# Altium schematic sheet connector.SchDoc: PCIE-Connector
size A4; Author: Marcel Hellwig; Organization: Hamburg Bit-Bots; Address1: Vogt-Kölln-Str. 30; Address2: 22527 Hamburg; Address3: Germany; Address4: www.bit-bots.de; DocumentNumber: 10; Revision: A; SheetNumber: 10; SheetTotal: 16; EMail: info@bit-bots.de
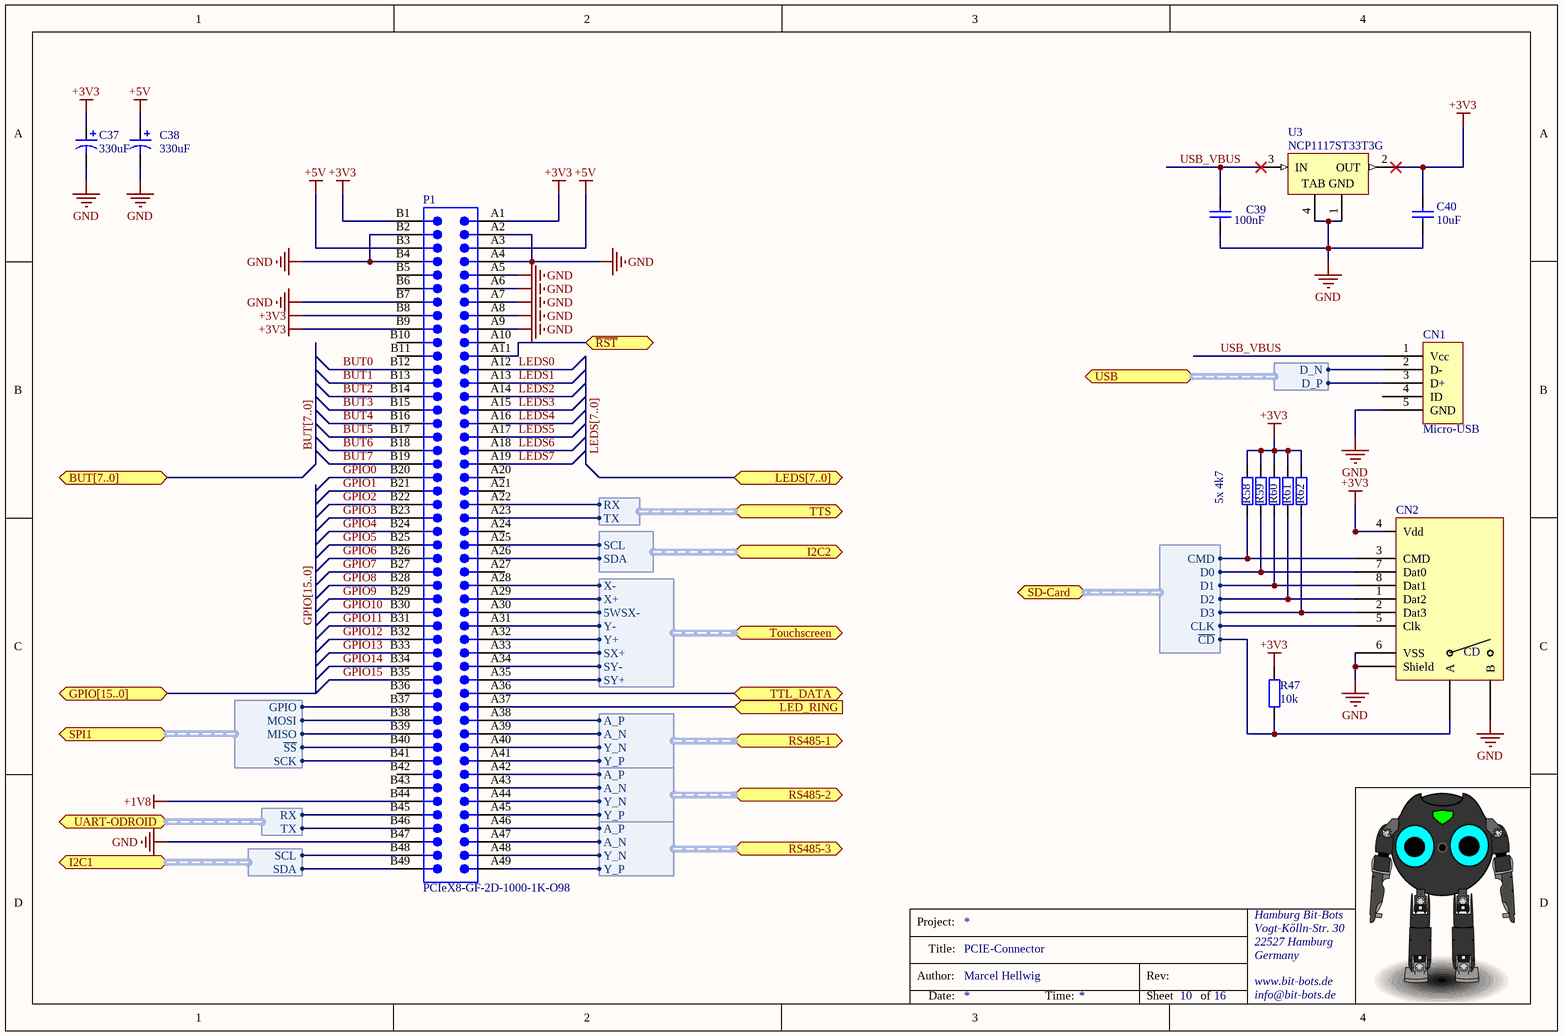
[diagram p0: connector.SchDoc]

## Parts
C37  330uF  [Cap 10mm]
C38  330uF  [Cap 10mm]
C39  100nF  [C2012]
C40  10uF  [C2012]
CN1  Micro-USB  [USB-MicroB]
CN2  microSD  [Microsd]  (value not drawn)
P1  PCIeX8-GF-2D-1000-1K-O98  [PCIeX8-GF-2D-1000-1K-O98]  (no BOM)
R47  10k  [R2012]
R58  4k7  [R2012]  (value not drawn)
R59  4k7  [R2012]  (value not drawn)
R60  4k7  [R2012]  (value not drawn)
R61  4k7  [R2012]  (value not drawn)
R62  4k7  [R2012]  (value not drawn)
U3  NCP1117ST33T3G  [ONSC-SOT-223_L]

## Ports
BUT[7..0] (bidir), GPIO[15..0] (bidir), I2C1 (harness I²C), I2C2 (harness I²C), LED_RING (in), LEDS[7..0] (bidir), RS485-1 (harness RS-485), RS485-2 (harness RS-485), RS485-3 (harness RS-485), SD-Card (harness SD-Card), SPI1 (harness SPI), Touchscreen (harness Touchscreen), TTL_DATA (bidir), TTS (harness UART), UART-ODROID (harness UART), USB (harness USB), ~{RST}

## Harnesses
USB: D_N, D_P
UART: RX, TX
I²C: SCL, SDA
Touchscreen: 5WSX-, SX+, SY-, SY+, X-, X+, Y-, Y+
RS-485: A_P, A_N, Y_P, Y_N
SD-Card: CLK, CMD, D0, D1, D2, D3, ~{CD}
SPI: ~{SS}, GPIO, MISO, MOSI, SCK

## Nets
+1V8: P1.B44
+3V3: C37.1 C40.2 CN2.4(Vdd) P1.A1 P1.B1 P1.B8 P1.B9 R47.2 R58.1 R59.1 R60.1 R61.1 R62.1 U3.2(OUT)
+5V: C38.1 P1.A3 P1.B3
GND: C37.2 C38.2 C39.1 C40.1 CN1.5(GND) CN2.6(VSS) CN2.B CN2.sh(Shield) P1.A2 P1.A4 P1.A5 P1.A6 P1.A7 P1.A8 P1.A9 P1.B2 P1.B4 P1.B7 P1.B47 U3.1(GND) U3.4(TAB)
~{RST}: P1.A11 ; port ~{RST}
BUT0: P1.B12
BUT1: P1.B13
BUT2: P1.B14
BUT3: P1.B15
BUT4: P1.B16
BUT5: P1.B17
BUT6: P1.B18
BUT7: P1.B19
GPIO0: P1.B20
GPIO1: P1.B21
GPIO2: P1.B22
GPIO3: P1.B23
GPIO4: P1.B24
GPIO5: P1.B25
GPIO6: P1.B26
GPIO7: P1.B27
GPIO8: P1.B28
GPIO9: P1.B29
GPIO10: P1.B30
GPIO11: P1.B31
GPIO12: P1.B32
GPIO13: P1.B33
GPIO14: P1.B34
GPIO15: P1.B35
LED_RING: P1.A37 ; port LED_RING
LEDS0: P1.A12
LEDS1: P1.A13
LEDS2: P1.A14
LEDS3: P1.A15
LEDS4: P1.A16
LEDS5: P1.A17
LEDS6: P1.A18
LEDS7: P1.A19
TTL_DATA: P1.A36 ; port TTL_DATA
USB_VBUS: C39.2 CN1.1(Vcc) U3.3(IN)
NetCN1_2: CN1.2(D-) ; port USB.D_N
NetCN1_3: CN1.3(D+) ; port USB.D_P
NetCN2_1: CN2.1(Dat2) R61.2 ; port SD-Card.D2
NetCN2_2: CN2.2(Dat3) R62.2 ; port SD-Card.D3
NetCN2_3: CN2.3(CMD) R58.2 ; port SD-Card.CMD
NetCN2_5: CN2.5(Clk) ; port SD-Card.CLK
NetCN2_7: CN2.7(Dat0) R59.2 ; port SD-Card.D0
NetCN2_8: CN2.8(Dat1) R60.2 ; port SD-Card.D1
NetCN2_A: CN2.A R47.1 ; port SD-Card.~{CD}
NetP1_A22: P1.A22 ; port TTS.RX
NetP1_A23: P1.A23 ; port TTS.TX
NetP1_A25: P1.A25 ; port I2C2.SCL
NetP1_A26: P1.A26 ; port I2C2.SDA
NetP1_A28: P1.A28 ; port Touchscreen.X-
NetP1_A29: P1.A29 ; port Touchscreen.X+
NetP1_A30: P1.A30 ; port Touchscreen.5WSX-
NetP1_A31: P1.A31 ; port Touchscreen.Y-
NetP1_A32: P1.A32 ; port Touchscreen.Y+
NetP1_A33: P1.A33 ; port Touchscreen.SX+
NetP1_A34: P1.A34 ; port Touchscreen.SY-
NetP1_A35: P1.A35 ; port Touchscreen.SY+
NetP1_A38: P1.A38 ; port RS485-1.A_P
NetP1_A39: P1.A39 ; port RS485-1.A_N
NetP1_A40: P1.A40 ; port RS485-1.Y_N
NetP1_A41: P1.A41 ; port RS485-1.Y_P
NetP1_A42: P1.A42 ; port RS485-2.A_P
NetP1_A43: P1.A43 ; port RS485-2.A_N
NetP1_A44: P1.A44 ; port RS485-2.Y_N
NetP1_A45: P1.A45 ; port RS485-2.Y_P
NetP1_A46: P1.A46 ; port RS485-3.A_P
NetP1_A47: P1.A47 ; port RS485-3.A_N
NetP1_A48: P1.A48 ; port RS485-3.Y_N
NetP1_A49: P1.A49 ; port RS485-3.Y_P
NetP1_B37: P1.B37 ; port SPI1.GPIO
NetP1_B38: P1.B38 ; port SPI1.MOSI
NetP1_B39: P1.B39 ; port SPI1.MISO
NetP1_B40: P1.B40 ; port SPI1.~{SS}
NetP1_B41: P1.B41 ; port SPI1.SCK
NetP1_B45: P1.B45 ; port UART-ODROID.RX
NetP1_B46: P1.B46 ; port UART-ODROID.TX
NetP1_B48: P1.B48 ; port I2C1.SCL
NetP1_B49: P1.B49 ; port I2C1.SDA

Not connected (* = marked no-connect by the designer): CN1 4(ID); P1 A10 A20 A21 A24 A27 B5 B6 B10 B11 B36 B42 B43

## Buses and harness runs
bus BUT[7..0] = port BUT[7..0]
bus GPIO[15..0] = port GPIO[15..0]
bus LEDS[7..0] = port LEDS[7..0]

## Notes on the sheet
- 5x 4k7
- Project:
- Author:
- Title:
- Rev:
- Date:
- Time:
- Sheet
- of
- (in symbol microSD) CD

## Library data of the parts
C37 C38 = Cap Pol1: Polarized Capacitor (Radial); Manufacturer: PANASONIC ELECTRONIC COMPONENTS; Manufacturer Part Number: EEE1VA331UAP; Published: 8-Jun-2000; LatestRevisionDate: 17-Jul-2002; LatestRevisionNote: Re-released for DXP Platform.; PackageReference: RB7.6-15; Publisher: Altium Limited; PackageDescription: Polarized Capacitor (Radial); 2 Leads; Value: 330uF; Supplier 1: Farnell; Supplier Part Number 1: 2326180; RoHS: YES; Stock 1: 534; Pricing 1: 1=0,89, 10=0,619, 50=0,445, 100=0,309, 250=0,279, 500=0,259, 2500=0,219, 5000=0,195 (EUR); ComponentLink1URL: http://www.farnell.com/datasheets/1790637.pdf; ComponentLink1Description: http://www.farnell.com/datasheets/1790637.pdf
C39 = Cap: Capacitor; Manufacturer: MULTICOMP; Manufacturer Part Number: MC0805B104K500CT; Produktpalette: Baureihe MC; Kapazität: 0.1; Kapazitätstoleranz: ±10%; Dielektrikum: X7; Nennspannung: 50; Keramikkondensatorgehäuse: 0805 [Metrisch 2012]; Betriebstemperatur, min.: -55; Betriebstemperatur, max.: 125; Verpackung: Gurtabschnitt; SVHC: No SVHC (17-Dec-2014); Betriebstemperatur: -55°C bis +125; Kondensatoranschlüsse: SMD<!--FANDB--><div class="features-and-benefits-container"></div>; Published: 8-Jun-2000; LatestRevisionDate: 17-Jul-2002; LatestRevisionNote: Re-released for DXP Platform.; PackageReference: RAD-0.3; Publisher: Altium Limited; PackageDescription: Radial Cap, Thru-Hole; 2 Leads; 0.3 in Pin Spacing; Value: 100nF; Supplier 1: Farnell; Supplier Part Number 1: 1759265; RoHS: YES; Stock 1: 692587; Pricing 1: 10=0,013, 100=0,011, 500=0,009, 1000=0,008, 2000=0,006 (EUR); MSL: -; Bauform: 0805 [Metrisch 2012]; Kapazitätstoleranz ±: ±10%; ComponentLink1URL: http://www.farnell.com/datasheets/1870456.pdf; ComponentLink1Description: http://www.farnell.com/datasheets/1870456.pdf
C40 = Cap: Capacitor; Manufacturer: MULTICOMP; Manufacturer Part Number: MC0805X106K250CT; Produktpalette: Baureihe MC; Kapazität: 10; Kapazitätstoleranz: ±10%; Dielektrikum: X5; Nennspannung: 25; Keramikkondensatorgehäuse: 0805 [Metrisch 2012]; Betriebstemperatur, min.: -55; Betriebstemperatur, max.: 85; Verpackung: Gurtabschnitt; Kondensatoranschlüsse: SMD<!--FANDB--><div class="features-and-benefits-container"></div>; Published: 8-Jun-2000; LatestRevisionDate: 17-Jul-2002; LatestRevisionNote: Re-released for DXP Platform.; PackageReference: RAD-0.3; Publisher: Altium Limited; PackageDescription: Radial Cap, Thru-Hole; 2 Leads; 0.3 in Pin Spacing; Value: 10uF; Supplier 1: Farnell; Supplier Part Number 1: 2320833; RoHS: YES; Stock 1: 46180; Pricing 1: 10=0,147, 100=0,121, 500=0,1, 1000=0,083, 1500=0,066 (EUR); MSL: MSL 1 - unbegrenzt; Bauform: 0805 [Metrisch 2012]; Kapazitätstoleranz ±: ±10%; ComponentLink1URL: http://www.farnell.com/datasheets/1870456.pdf; ComponentLink1Description: http://www.farnell.com/datasheets/1870456.pdf
CN1 = USB-MicroB: Manufacturer: Molex; Manufacturer Part Number: 105017-0001; Verbindungstyp: Micro USB Type B Receptacle; Kontaktüberzug: Gold; Nennstrom: 1.8 A; Anschlussart: Male; Anzahl der Kontakte: 5; Verpackung: Reel; Produkt: Micro USB Type B Connectors; Serie: 105017; Klemmenart: Solder Tab; Nennspannung: 30 VAC; Kontaktmaterial: Copper Alloy; Anzahl der Ports: 1; Produktkategorie: USB Connectors; Supplier 1: Mouser; Supplier Part Number 1: 538-105017-0001; RoHS: RoHS Compliant; Category: USB-Stecker; Stock 1: 8793; Pricing 1: 1=0.787, 10=0.691, 25=0.650, 50=0.623, 100=0.595, 250=0.507, 500=0.480, 1000=0.389, 2000=0.326 (EUR); Fabrikat: Molex; Hersteller: Molex; Standardpackungsmenge: 14000; RoHS - Mouser: Y; Minimum Order Quantity: 1; Reeling: True; ComponentLink1URL: http://www.mouser.com/ds/2/276/1050170001_IO_CONNECTORS-230168.pdf; ComponentLink1Description: http://www.mouser.com/ds/2/276/1050170001_IO_CONNECTORS-230168.pdf
CN2 = microSD: Micro SD Card Connector; Supplier 1: Farnell; Supplier Part Number 1: 2427719
P1 = CMP-0001-00032-2: Golden finger, PCIeX8, Dual, Opposite, Pitch 1mm, 98-Position; Mating Connector: Molex-87715-9205; Datasheet Version: rev2.0, Apr-2007; ClassName: Edge Connector; Publisher: Altium; Package Reference: PCIeX8-GF-2D-1000-1K-O98
R47 = Res2: Resistor; Manufacturer: MULTICOMP; Manufacturer Part Number: MC01W0805110K; Published: 8-Jun-2000; LatestRevisionDate: 17-Jul-2002; LatestRevisionNote: Re-released for DXP Platform.; PackageReference: AXIAL-0.4; Publisher: Altium Limited; PackageDescription: Axial Device, Thru-Hole; 2 Leads; 0.4 in Pin Spacing; Value: 10k; Supplier 1: Farnell; Supplier Part Number 1: 9332391; RoHS: Y-EX; Stock 1: 4370; Pricing 1: 50=0,038, 250=0,031, 1000=0,022, 5000=0,014, 15000=0,009 (EUR); ComponentLink1URL: http://www.farnell.com/datasheets/1729047.pdf; ComponentLink1Description: http://www.farnell.com/datasheets/1729047.pdf; ComponentLink2URL: http://www.farnell.com/cad/1561156.zip; ComponentLink2Description: http://www.farnell.com/cad/1561156.zip
R58-R62 = Res2: Resistor; Manufacturer: MULTICOMP; Manufacturer Part Number: MC01W080514K7; Produktpalette: Baureihe MC; Widerstand: 4.7; Nennleistung: 100; Widerstandstoleranz: ±1%; Bauform: 0805 [Metrisch 2012]; Widerstandselement: Dickschicht; Temperaturkoeffizient: ±100; Nennspannung: 150; Verpackung: Gurtabschnitt; SVHC: No SVHC (17-Dec-2014); Anzahl der Pins: 2; Außenbreite: 1.25; Außentiefe: 0.55; Bandbreite: 8; Baureihe: MC; Betriebstemperatur: -55°C bis +155; Betriebstemperatur, max.: 155; Betriebstemperatur, min.: -55; Menge pro Rolle: 5000; Toleranz (+): 1%; Widerstandsmontage: Oberflächenmontage<!--FANDB--><div class="features-and-benefits-container"></div>; Published: 8-Jun-2000; LatestRevisionDate: 17-Jul-2002; LatestRevisionNote: Re-released for DXP Platform.; PackageReference: AXIAL-0.4; Publisher: Altium Limited; PackageDescription: Axial Device, Thru-Hole; 2 Leads; 0.4 in Pin Spacing; Value: 4k7; Supplier 1: Farnell; Supplier Part Number 1: 9333266; RoHS: Y-EX; Stock 1: 190984; Pricing 1: 50=0,038, 250=0,031, 1000=0,022, 5000=0,014, 15000=0,009 (EUR); MSL: -; Außenlänge/-höhe: 2; Nennspannung, V DC: 150; Temperaturkoeffizient, +: 100; Temperaturkoeffizient, -: 100; Toleranz (-): 1%; ComponentLink1URL: http://www.farnell.com/datasheets/1729047.pdf; ComponentLink1Description: http://www.farnell.com/datasheets/1729047.pdf; ComponentLink2URL: http://www.farnell.com/cad/1561170.zip; ComponentLink2Description: http://www.farnell.com/cad/1561170.zip
U3 = CMP-0592-00001-2: 1.0 A Low-Dropout Positive Fixed Voltage Regulator, 5 V Vout, 0 to 125 degC, 4-Pin SOT-223, Pb-Free, Tape and Reel; PartNumber: NCP1117ST50T3G; Manufacturer: ON Semiconductor; IQ: 6 mA; Iout (Min): 1 A; Nominal Output Voltage: 3.3 V; Vin: 20 V; RR: 61 dB; Dropout Voltage: 1.2 V; Packing: Tape and Reel; DatasheetVersion: Rev. 26; ComponentLink3URL: http://www.onsemi.com/pub_link/Collateral/318H-01.PDF; ComponentLink2URL: http://www.onsemi.com/pub_link/Collateral/NCP1117-D.PDF; Mounting Technology: Surface Mount; ComponentLink2Description: Datasheet; Operating Temperature: 0 to 125 degC; ComponentLink1Description: Manufacturer URL; PackageDescription: 4-Pin Small Out-Line Transistor, Body 3.5 x 6.5 mm, Pitch 2.3 mm; ComponentLink1URL: http://www.onsemi.com/; PackageReference: SOT-223; ComponentLink3Description: Package Specification; Supplier 1: Farnell; Supplier Part Number 1: 1652366